# EAGLE design moon-germs (EAGLE 9.1.3)
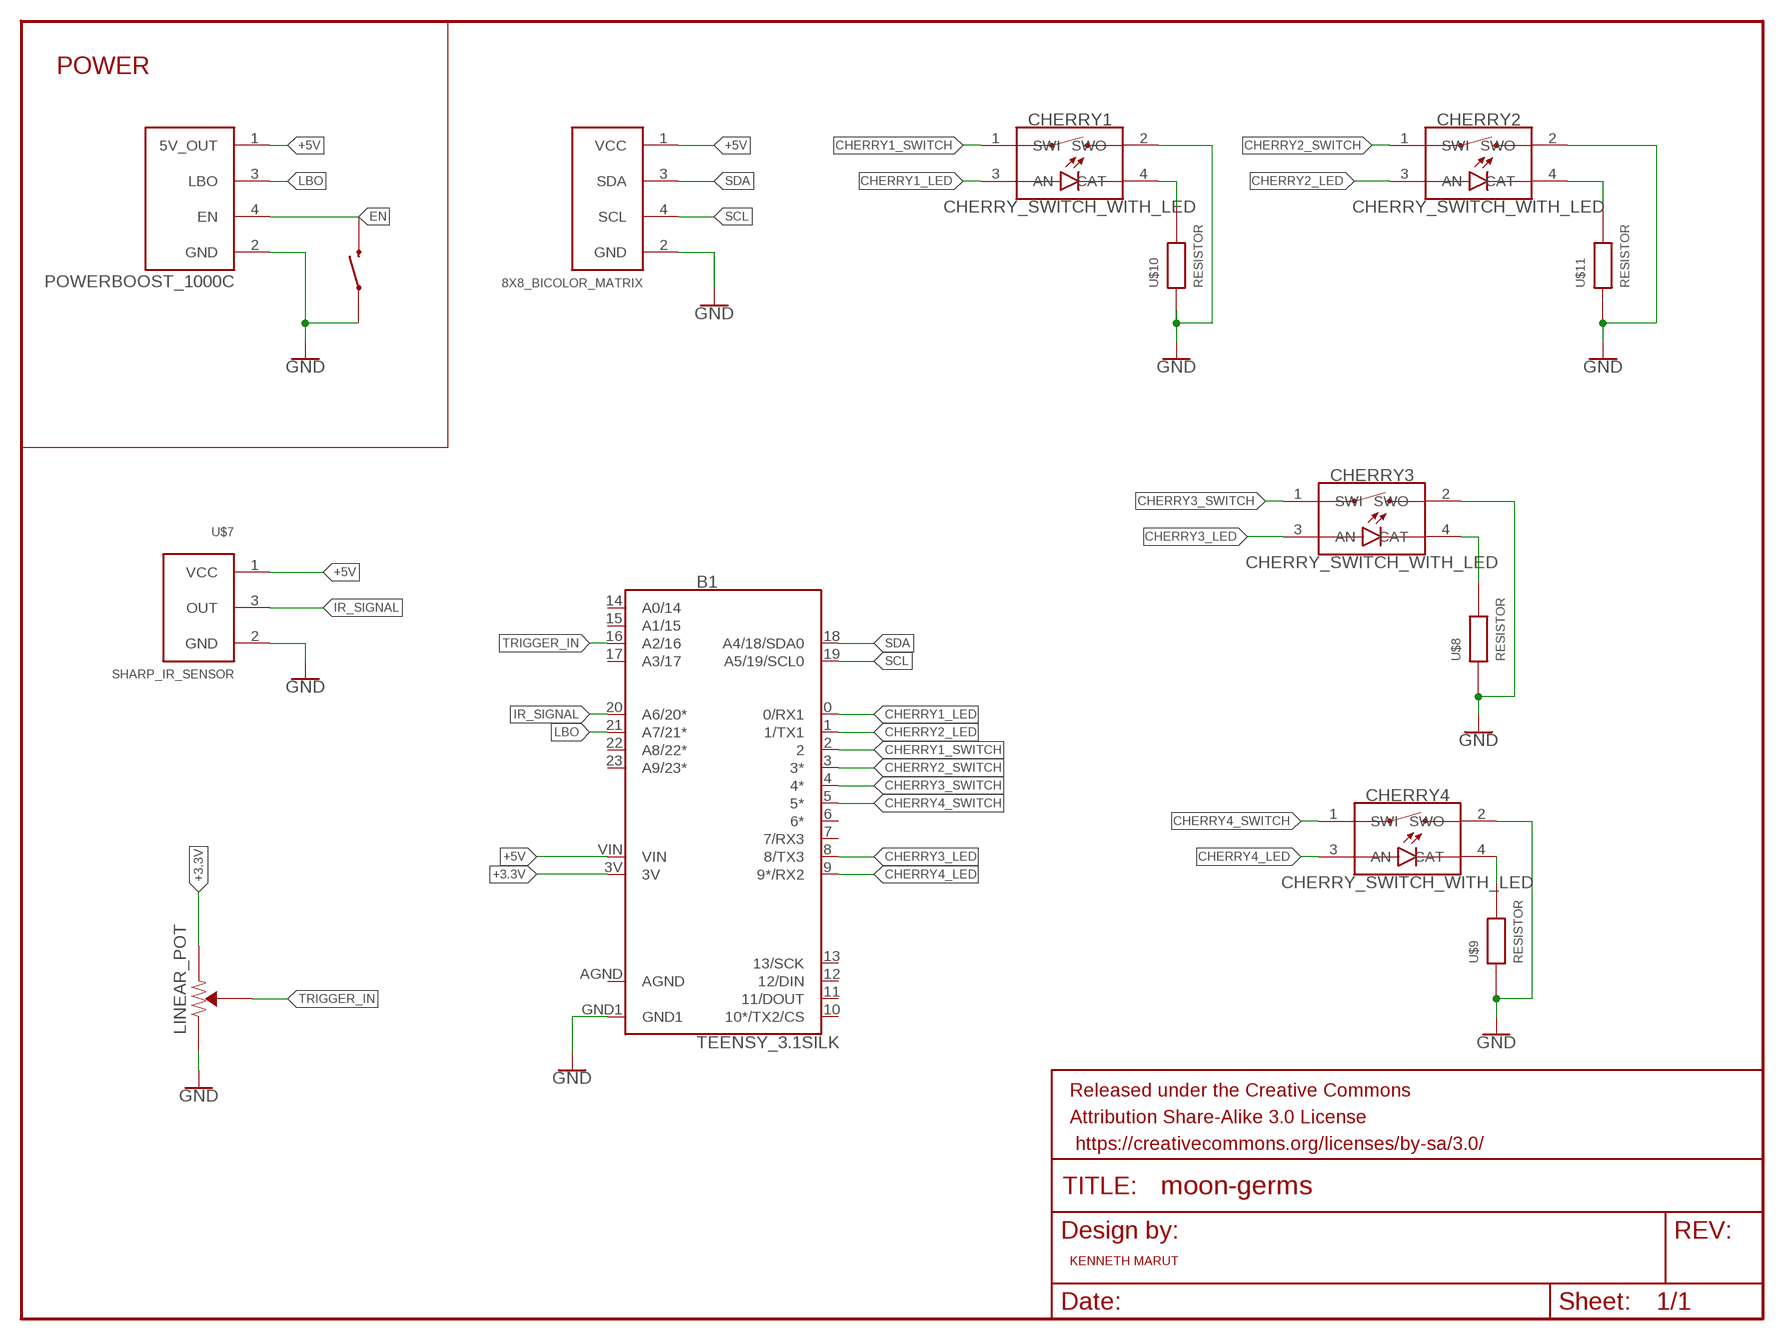
[diagram p0: schematic, sheet 1]

## Parts
B1  TEENSY_3.1SILK  [TEENSY_3.1]
CHERRY1  CHERRY_SWITCH_WITH_LED  [1X04]
CHERRY2  CHERRY_SWITCH_WITH_LED  [1X04]
CHERRY3  CHERRY_SWITCH_WITH_LED  [1X04]
CHERRY4  CHERRY_SWITCH_WITH_LED  [1X04]
FRAME1  FRAME-LETTER  [CREATIVE_COMMONS]
U$1  8X8_BICOLOR_MATRIX  [1X04]
U$6  SPST-SWITCH  [1X02]
U$7  SHARP_IR_SENSOR  [1X03]
U$8  RESISTOR  [0805]
U$9  RESISTOR  [0805]
U$10  RESISTOR  [0805]
U$11  RESISTOR  [0805]
U$12  POWERBOOST_1000C  [1X04]
U$13  LINEAR_POT  [1X03]

## Nets
+3.3V: B1.3V U$13.1(+)
+5V: B1.VIN U$1.1(VCC) U$7.1(VCC) U$12.1(5V_OUT)
CHERRY1_LED: B1.0(0/RX1) CHERRY1.3(AN)
CHERRY1_SWITCH: B1.2 CHERRY1.1(SWI)
CHERRY2_LED: B1.1(1/TX1) CHERRY2.3(AN)
CHERRY2_SWITCH: B1.3(3*) CHERRY2.1(SWI)
CHERRY3_LED: B1.8(8/TX3) CHERRY3.3(AN)
CHERRY3_SWITCH: B1.4(4*) CHERRY3.1(SWI)
CHERRY4_LED: B1.9(9*/RX2) CHERRY4.3(AN)
CHERRY4_SWITCH: B1.5(5*) CHERRY4.1(SWI)
EN: U$6.2(SWO) U$12.4(EN)
GND: B1.GND1 CHERRY1.2(SWO) CHERRY2.2(SWO) CHERRY3.2(SWO) CHERRY4.2(SWO) U$1.2(GND) U$6.1(SWI) U$7.2(GND) U$8.1 U$9.1 U$10.1 U$11.1 U$12.2(GND) U$13.3(-)
IR_SIGNAL: B1.20(A6/20*) U$7.3(OUT)
LBO: B1.21(A7/21*) U$12.3(LBO)
N$2: CHERRY1.4(CAT) U$10.2
N$3: CHERRY4.4(CAT) U$9.2
N$4: CHERRY3.4(CAT) U$8.2
N$5: CHERRY2.4(CAT) U$11.2
SCL: B1.19(A5/19/SCL0) U$1.4(SCL)
SDA: B1.18(A4/18/SDA0) U$1.3(SDA)
TRIGGER_IN: B1.16(A2/16) U$13.2(W)
Unconnected: B1.6(6*) B1.7(7/RX3) B1.10(10*/TX2/CS) B1.11(11/DOUT) B1.12(12/DIN) B1.13(13/SCK) B1.14(A0/14) B1.15(A1/15) B1.17(A3/17) B1.22(A8/22*) B1.23(A9/23*)

## Notes on the sheet
- POWER
- KENNETH MARUT

## Power pins joined to a net without a drawn wire
AGND: B1.AGND

## Library data of the parts
B1 = moon-germs:TEENSY_3.1: Teensy 3+ Footprint Mechanical footprint with connectors for Teensy Development Board with ARM Cortex. SparkFun Products: Teensy 3.2 <https://www.sparkfun.com/products/13736> Teensy LC <https://www.sparkfun.com/products/13305>; SF_ID: DEV-12646
CHERRY1-CHERRY4 = moon-germs:CHERRY_SWITCH_WITH_LED
FRAME1 = SparkFun-Retired:FRAME-LETTER: Schematic Frame Standard 8.5x11 US Letter frame
U$1 = moon-germs:8X8_BICOLOR_MATRIX
U$6 = moon-germs:SPST-SWITCH
U$7 = moon-germs:SHARP_IR_SENSOR
U$8-U$11 = moon-germs:RESISTOR
U$12 = moon-germs:POWERBOOST_1000C
U$13 = moon-germs:LINEAR_POT

## Board
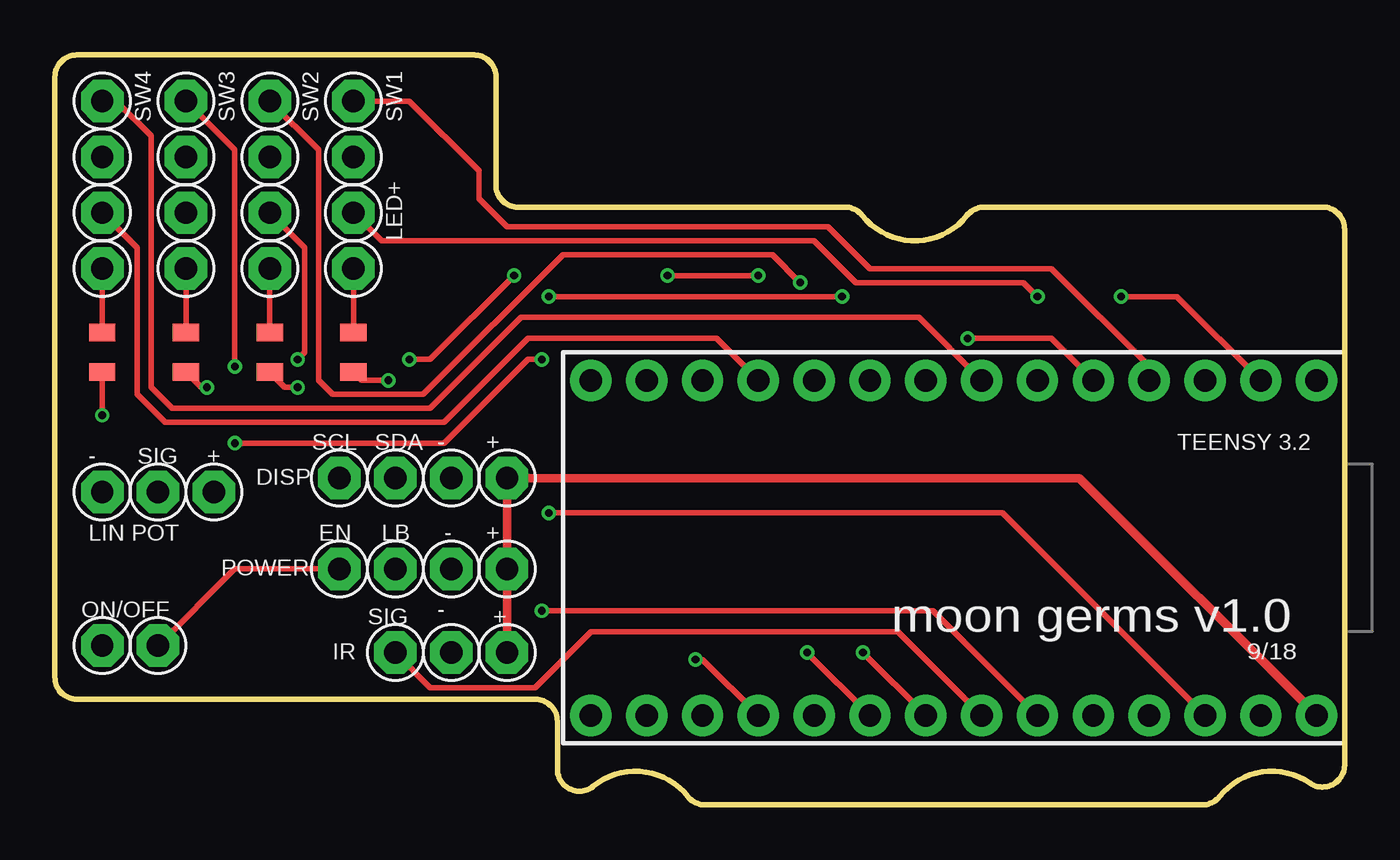
[diagram p1: board, top side]
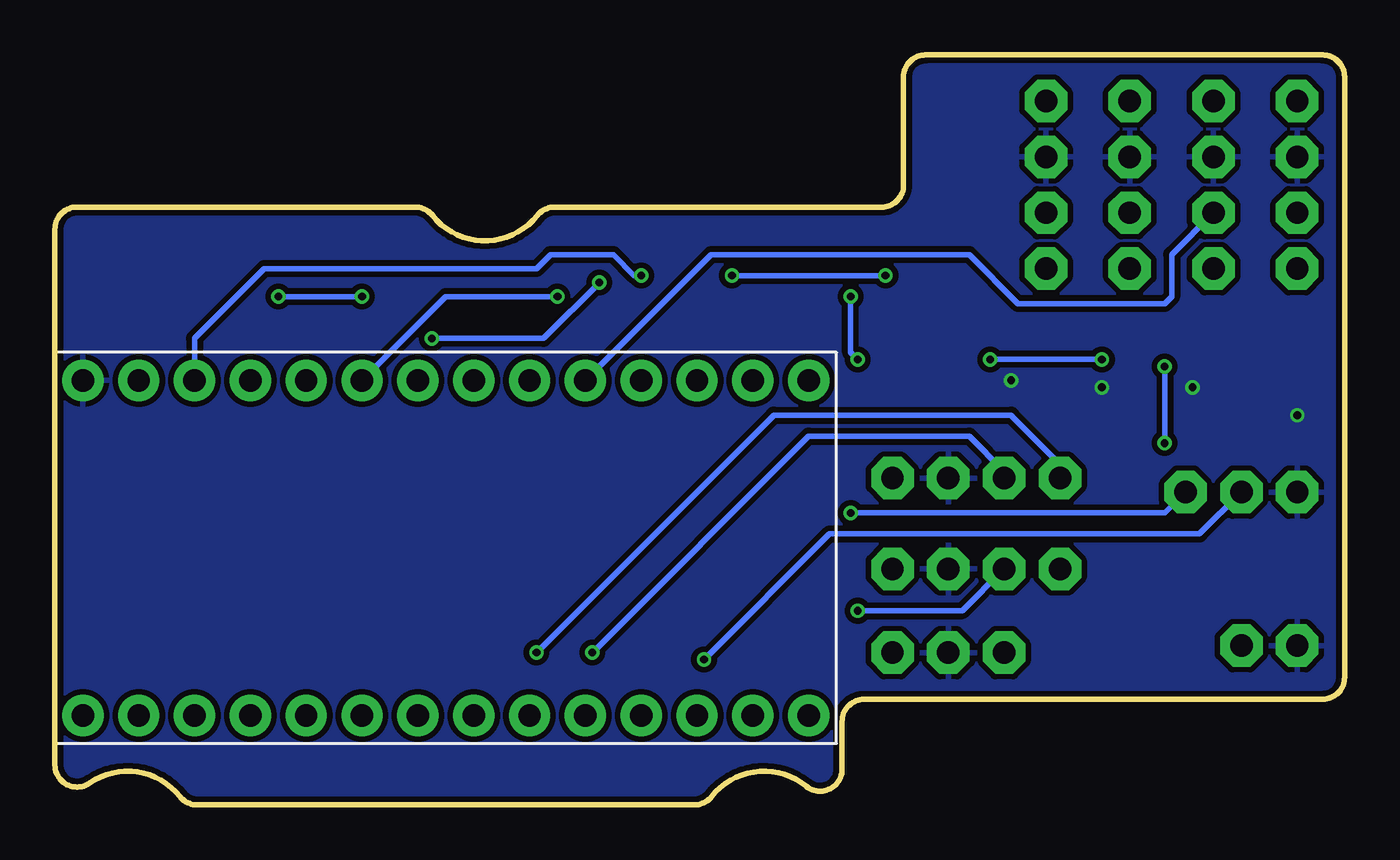
[diagram p2: board, bottom side, seen from below]

Size 58.67 x 34.1 mm. Coordinates in mm from the lower left corner, seen from the top.
Outline: 35.94,27.18 arc-52 36.72,26.81 arc103 41.5,26.81 arc-52 42.28,27.18 57.67,27.18 arc-90 58.67,26.18 58.67,1.81 arc-125 57.1,0.99 arc86 52.98,0.38 arc-52 52.19,0 29.58,0 arc-52 28.8,0.38 arc91 24.49,0.85 arc-129 22.86,1.62 22.86,3.8 arc90 21.86,4.8 1,4.8 arc-90 0,5.8 0,33.1 arc-90 1,34.1 19.06,34.1 arc-90 20.06,33.1 20.06,28.18 arc90 21.06,27.18 35.94,27.18
Copper layers (1*16): Top 0.035mm / dielectric 1.5mm / Bottom 0.035mm
Design rules "SeeedStudio_2layer_DRU_no_angle_20140221": minimum track width 6mil, minimum drill 12mil, track to track 6mil, track to pad 6mil, pad to pad 6mil, via to via 6mil, smd to smd 0mil, copper to edge 10mil, drill to drill 10mil, minimum pad ring 10mil, minimum via ring 6mil, stop-mask expansion 2mil, vias tented up to drill 100mil, thermal gap 10mil

### Footprints (pad centres in the part's own frame; a part is rotated, then mirrored left to right if it is on the bottom)
TEENSY_3.1 = drill 1.016 pad 1.88: 0 7.62,-13.97; 1 7.62,-11.43; 2 7.62,-8.89; 3 7.62,-6.35; 3V -7.62,-11.43; 4 7.62,-3.81; 5 7.62,-1.27; 6 7.62,1.27; 7 7.62,3.81; 8 7.62,6.35; 9 7.62,8.89; 10 7.62,11.43; 11 7.62,13.97; 12 7.62,16.51; 13 -7.62,16.51; 14 -7.62,13.97; 15 -7.62,11.43; 16 -7.62,8.89; 17 -7.62,6.35; 18 -7.62,3.81; 19 -7.62,1.27; 20 -7.62,-1.27; 21 -7.62,-3.81; 22 -7.62,-6.35; 23 -7.62,-8.89; AGND -7.62,-13.97; GND1 7.62,-16.51; VIN -7.62,-16.51
1X04 = drill 1.016 pad 1.93 octagon: 1 0,0; 2 2.54,0; 3 5.08,0; 4 7.62,0
1X02 = drill 1.016 pad 1.93 octagon: 1 0,0; 2 2.54,0
1X03 = drill 1.016 pad 1.93 octagon: 1 0,0; 2 2.54,0; 3 5.08,0
0805 = smd 0.8 x 1.2: 1 -0.9,0; 2 0.9,0

### Placement (x,y rotation side)
B1  40.89,11.69 90 top
CHERRY1  13.58,32.01 270 top
CHERRY2  9.77,32.01 270 top
CHERRY3  5.96,32.01 270 top
CHERRY4  2.15,32.01 270 top
FRAME1  -53.09,44.71 0 top  (outside the outline)
U$1  20.57,14.86 180 top
U$6  2.15,7.24 0 top
U$7  20.57,6.92 180 top
U$8  5.96,20.58 90 top
U$9  2.15,20.58 90 top
U$10  13.58,20.58 90 top
U$11  9.77,20.58 90 top
U$12  20.57,10.73 180 top
U$13  7.23,14.23 180 top

### Tracks (layer width: path | path; a pad name or v marks a point on that pad's centre or on a via)
+3.3V  (via drill 0.35)
  Top 0.254: B1.3V 43.11,13.27 v22.47,13.27
  Bottom 0.254: v22.47,13.27 8.18,13.27 U$13.1
+5V
  Top 0.381: B1.VIN 46.6,14.86 U$1.1 U$12.1 U$7.1
CHERRY1_LED  (via drill 0.35)
  Top 0.254: CHERRY1.3 14.85,25.66 34.54,25.66 36.44,23.75 44.06,23.75 v44.7,23.12 | v48.51,23.12 51.05,23.12 B1.0
  Bottom 0.254: v44.7,23.12 v48.51,23.12
CHERRY1_SWITCH
  Top 0.254: CHERRY1.1 16.12,32.01 19.3,28.83 19.3,27.56 20.57,26.29 35.17,26.29 37.08,24.39 45.33,24.39 49.78,19.94 B1.2
CHERRY2_LED  (via drill 0.35)
  Top 0.254: CHERRY2.3 11.36,25.34 11.36,20.58 v11.04,20.26 | v16.12,20.26 17.07,20.26 v20.88,24.07 | v27.87,24.07 v32,24.07
  Bottom 0.254: v11.04,20.26 v16.12,20.26 | v20.88,24.07 v27.87,24.07 | v32,24.07 32.31,24.07 33.27,25.02 36.12,25.02 36.76,24.39 49.14,24.39 52.32,21.21 B1.1
CHERRY2_SWITCH  (via drill 0.35)
  Top 0.254: CHERRY2.1 11.99,29.79 11.99,19.31 12.63,18.67 16.76,18.67 23.11,25.02 32.63,25.02 v33.9,23.75 | v41.52,21.21 45.33,21.21 B1.3
  Bottom 0.254: v33.9,23.75 36.44,21.21 v41.52,21.21
CHERRY3_LED
  Bottom 0.254: CHERRY3.3 7.87,25.02 7.87,23.12 8.18,22.8 14.85,22.8 17.07,25.02 28.82,25.02 B1.8
CHERRY3_SWITCH  (via drill 0.35)
  Top 0.254: CHERRY3.1 8.18,29.79 v8.18,19.94 | v22.47,23.12 v35.81,23.12 | v8.18,16.45 17.71,16.45 21.52,20.26 v22.15,20.26
  Bottom 0.254: v8.18,19.94 v8.18,16.45 | v22.15,20.26 22.47,20.58 v22.47,23.12 | v35.81,23.12 40.89,23.12 B1.4
CHERRY4_LED
  Top 0.254: CHERRY4.3 3.74,25.34 3.74,18.67 5.01,17.4 17.71,17.4 21.52,21.21 30.09,21.21 B1.9
CHERRY4_SWITCH
  Top 0.254: CHERRY4.1 2.79,32.01 4.37,30.42 4.37,18.99 5.33,18.04 17.07,18.04 21.2,22.17 39.3,22.17 B1.5
EN
  Top 0.254: U$12.4 8.18,10.74 U$6.2
GND  (via drill 0.35)
  Top 0.254: U$9.1 v2.15,17.72 | U$8.1 6.65,18.99 v6.91,18.99 | U$11.1 10.46,18.99 v11.04,18.99 | U$10.1 13.95,19.31 v15.17,19.31
  pour Bottom (isolate 0.254): 19.3,34.55 -1.02,34.55 -1.02,4.07 21.84,4.07 21.84,-1.01 59.94,-1.01 59.94,28.2 21.84,28.2 21.84,34.55
IR_SIGNAL
  Top 0.254: B1.20 38.35,7.88 24.38,7.88 21.84,5.34 17.07,5.34 U$7.3
LBO  (via drill 0.35)
  Top 0.254: B1.21 39.93,8.83 v22.15,8.83
  Bottom 0.254: v22.15,8.83 17.39,8.83 U$12.3
N$2
  Top 0.254: CHERRY1.4 U$10.2
N$3
  Top 0.254: CHERRY4.4 U$9.2
N$4
  Top 0.254: CHERRY3.4 U$8.2
N$5
  Top 0.254: CHERRY2.4 U$11.2
SCL  (via drill 0.35)
  Top 0.254: B1.19 v36.76,6.92
  Bottom 0.254: v36.76,6.92 25.96,17.72 15.17,17.72 12.95,15.5 U$1.4
SDA  (via drill 0.35)
  Top 0.254: B1.18 v34.22,6.92
  Bottom 0.254: v34.22,6.92 24.38,16.77 17.07,16.77 15.49,15.18 U$1.3
TRIGGER_IN  (via drill 0.35)
  Top 0.254: B1.16 29.46,6.61 v29.14,6.61
  Bottom 0.254: v29.14,6.61 23.42,12.32 6.6,12.32 U$13.2

### Text on the board
tPlace: SW4 | SW3 | SW2 | SW1 | LED+ | SCL | SDA | - | + | TEENSY 3.2 | - | SIG | + | DISP | LIN POT | EN | LB | - | + | POWER | ON/OFF | SIG | - | + | moon germs v1.0 | IR | 9/18